# Altium schematic sheet LoRa Concentrator.SchDoc: Yonder Parent TS-4900 Version
size Letter; DrawnBy: MTAN; Organization: Altium Limited; DocumentNumber: 3; Revision: D; SheetNumber: 3; SheetTotal: 5
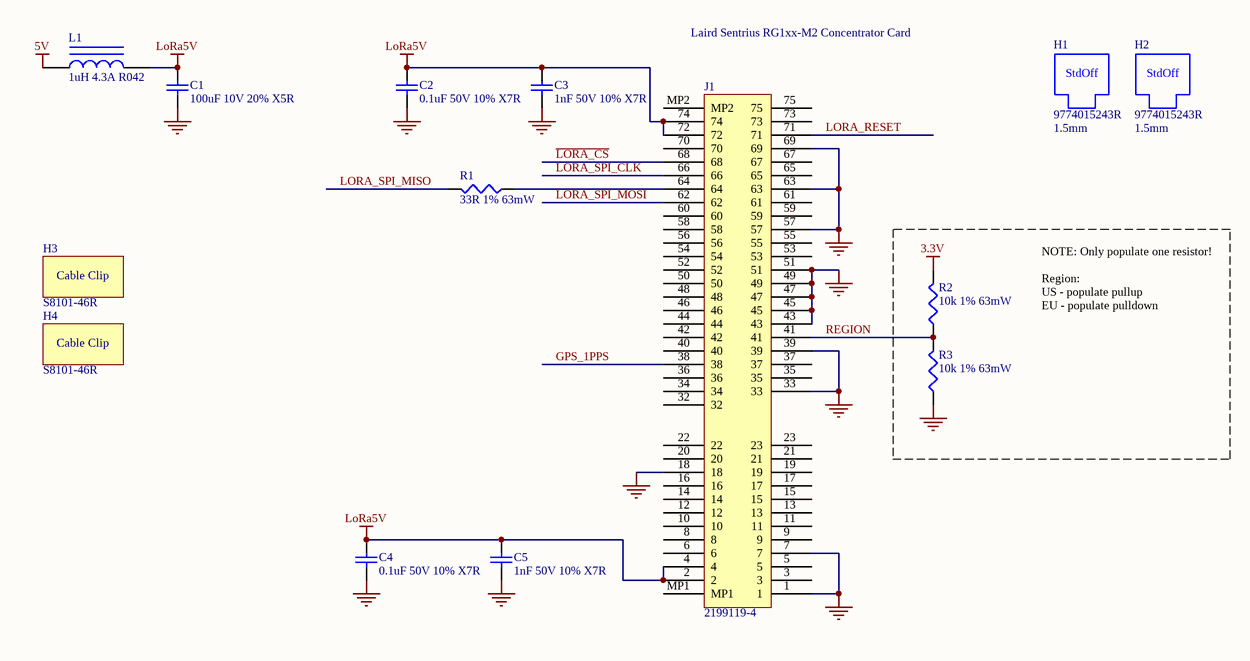
[diagram p0: LoRa Concentrator.SchDoc]

## Parts
C1  100uF 10V 20% X5R  [C1210_L]
C2  0.1uF 50V 10% X7R  [CAPC1005L]
C3  1nF 50V 10% X7R  [CAPC1005L]
C4  0.1uF 50V 10% X7R  [CAPC1005L]
C5  1nF 50V 10% X7R  [CAPC1005L]
H1  9774015243R  Height: 1.5mm  [Wurth 9774015243R]
H2  9774015243R  Height: 1.5mm  [Wurth 9774015243R]
H3  S8101-46R  [Coax Cable Clip]
H4  S8101-46R  [Coax Cable Clip]
J1  2199119-4  [TE 2199119-4]
L1  1uH 4.3A R042  [WE-LQS 252012]
R1  33R 1% 63mW  [RESC1005L]
R2  10k 1% 63mW  [RESC1005L]
R3  10k 1% 63mW  [RESC1005L]

## Nets
3.3V: R2.2
5V: L1.1
GND: C1.1 C2.2 C3.2 C4.2 C5.2 J1.1 J1.7 J1.18 J1.33 J1.39 J1.43 J1.45 J1.47 J1.49 J1.51 J1.57 J1.63 J1.69 R3.1
LoRa5V: C1.2 C2.1 C3.1 C4.1 C5.1 J1.2 J1.4 J1.72 J1.74 L1.2
GPS_1PPS: J1.38
~{LORA_CS}: J1.68
LORA_RESET: J1.71
LORA_SPI_CLK: J1.66
LORA_SPI_MISO: R1.2
LORA_SPI_MOSI: J1.62
REGION: J1.41 R2.1 R3.2
NetJ1_64: J1.64 R1.1

Not connected (* = marked no-connect by the designer): J1 3 5 6 8 9 10 11 12 13 14 15 16 17 19 20 21 22 23 32 34 35 36 37 40 42 44 46 48 50 52 53 54 55 56 58 59 60 61 65 67 70 73 75 MP1 MP2

## Notes on the sheet
- Laird Sentrius RG1xx-M2 Concentrator Card
- NOTE: Only populate one resistor!
  Region:
  US - populate pullup
  EU - populate pulldown
- Title
- Drawn By:
- Date:
- Time:
- Revision:
- Sheet
- of
- The Latium Group of Companies
- 1312 10 Street
- Nisku, Alberta
- T9E 8K2
- Canada
- File:
- (in symbol SMD 1.5mm Spacer) StdOff

## Library data of the parts
C1-C5 = Cap: Capacitor
  C1: Value: 100uF 10V 20% X5R
  C2 C4: Value: 0.1uF 50V 10% X7R
  C3 C5: Value: 1nF 50V 10% X7R
H1 H2 = SMD 1.5mm Spacer: RND STANDOFF M2X0.4 STEEL; Manufacturer: Wurth Electronics Inc; Supplier 1: Digi-Key; Value: 9774015243R; Manufacturer Part Number: 9774015243R; Supplier 1 Part Number: 732-7069-1-ND; ComponentLink1Description: Drawing; ComponentLink1URL: S:\Hardware\Data Sheets\Passive\Standoffs\Wurth 9774015243R.pdf
H3 H4 = Cable Clip: CBL CLIP C-TYPE SILVER SOLDER; Manufacturer: Harwin Inc; Value: S8101-46R; ComponentLink1Description: Drawing; ComponentLink1URL: S:\Hardware\Data Sheets\Passive\Strain Reliefs\S8101R.pdf; Manufacturer Part Number: S8101-46R; Supplier 1: Digi-Key; Supplier 1 Part Number: 952-1576-1-ND
J1 = TE2199119-4: CONN FEMALE 67POS 0.020 GOLD; Manufacturer: TE Connectivity AMP Connectors; Value: 2199119-4; Manufacturer Part Number: 2199119-4; ComponentLink1Description: Data Sheet; ComponentLink1URL: S:\Hardware\Data Sheets\Passive\Connectors\TE NGFF M2 Connector.pdf; Supplier 1: Digi-Key; Supplier 1 Part Number: A115900CT-ND
L1 = Inductor Iron: FIXED IND 1UH 4.3A 42 MOHM SMD; Manufacturer Part Number: DFE252012P-1R0M=P2; Manufacturer: Murata Electronics; Value: 1uH 4.3A R042; Supplier 1: Digi-Key; Supplier 1 Part Number: 490-10647-1-ND
R1-R3 = Res3: Resistor
  R1: Value: 33R 1% 63mW
  R2 R3: Value: 10k 1% 63mW